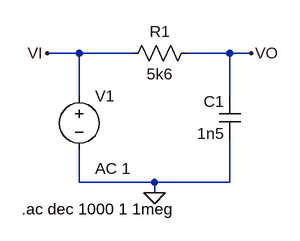
[diagram p0: schematic Ejercicio_1.asc]
Ejercicio_1.asc, the LTspice schematic file:
Version 4
SHEET 1 880 680
WIRE 0 32 -48 32
WIRE 80 32 0 32
WIRE 224 32 160 32
WIRE 256 32 224 32
WIRE 0 96 0 32
WIRE 224 96 224 32
WIRE 0 224 0 176
WIRE 112 224 0 224
WIRE 224 224 224 160
WIRE 224 224 112 224
WIRE 112 240 112 224
FLAG 112 240 0
FLAG 256 32 VO
FLAG -48 32 VI
SYMBOL voltage 0 80 R0
WINDOW 123 24 124 Left 2
WINDOW 39 0 0 Left 0
SYMATTR InstName V1
SYMATTR Value ""
SYMATTR Value2 AC 1
SYMBOL res 176 16 R90
WINDOW 0 0 56 VBottom 2
WINDOW 3 32 56 VTop 2
SYMATTR InstName R1
SYMATTR Value 5k6
SYMBOL cap 240 160 R180
WINDOW 0 24 56 Left 2
WINDOW 3 24 8 Left 2
SYMATTR InstName C1
SYMATTR Value 1n5
TEXT -86 264 Left 2 !.ac dec 1000 1 1meg

The netlist it stands for:
* Ejercicio_1.asc
V1 VI 0 AC 1
R1 VO VI 5k6
C1 0 VO 1n5
.ac dec 1000 1 1meg
.backanno
.end